# EAGLE design simpleCH552 (EAGLE 9.5.0)
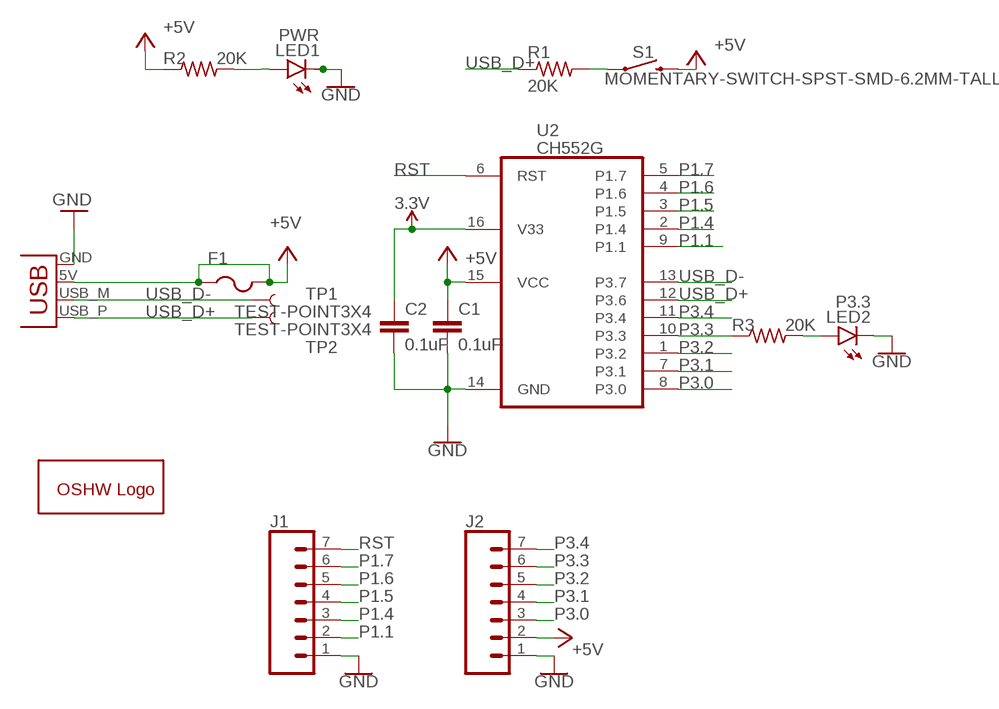
[diagram p0: schematic, sheet 1]

## Parts
C1  0.1uF  C-EUC0805K  [C0805K]
C2  0.1uF  C-EUC0805K  [C0805K]
F1  PTCFUSE-1206  [R1206]
GOLD_ORB_SM1  OSHWLOGOLOGO8MM  [OSHW_8MM]
J1  CONN_07NO_SILK  [1X07_NO_SILK]
J2  CONN_07NO_SILK  [1X07_NO_SILK]
LED1  PWR  GHI-BASICCOMPONENTS_LED-(INCH)-0805  [GHI-BASICCOMPONENTS_0805-LED]
LED2  P3.3  GHI-BASICCOMPONENTS_LED-(INCH)-0805  [GHI-BASICCOMPONENTS_0805-LED]
R1  20K  R-US_R0805  [R0805]
R2  20K  R-US_R0805  [R0805]
R3  20K  R-US_R0805  [R0805]
S1  MOMENTARY-SWITCH-SPST-SMD-6.2MM-TALL  [TACTILE_SWITCH_SMD_6.2MM_TALL]
TP1  TEST-POINT3X4  [PAD.03X.04]
TP2  TEST-POINT3X4  [PAD.03X.04]
U2  CH552G  MY_IC_CH551G_CH552GSOP-16  [MY_IC_SO16]
X1  USBPCB  [USB-A-PCB]

## Nets
3.3V: C2.1 U2.16(V33)
+5V: C1.1 F1.1 F1.2 J2.2 R2.1 S1.B2 U2.15(VCC) X1.5V(VBUS)
GND: C1.2 C2.2 J1.1 J2.1 LED1.K LED2.K U2.14(GND) X1.GND
N$1: R1.2 S1.A2
N$2: LED2.A R3.2
N$3: LED1.A R2.2
P1.1: J1.2 U2.9(P1.1)
P1.4: J1.3 U2.2(P1.4)
P1.5: J1.4 U2.3(P1.5)
P1.6: J1.5 U2.4(P1.6)
P1.7: J1.6 U2.5(P1.7)
P3.0: J2.3 U2.8(P3.0)
P3.1: J2.4 U2.7(P3.1)
P3.2: J2.5 U2.1(P3.2)
P3.3: J2.6 R3.1 U2.10(P3.3)
P3.4: J2.7 U2.11(P3.4)
RST: J1.7 U2.6(RST)
USB_D+: R1.1 TP2.P$1 U2.12(P3.6) X1.USB_P(D+)
USB_D-: TP1.P$1 U2.13(P3.7) X1.USB_M(D-)

## Library data of the parts
C1 C2 = rcl:C-EU: CAPACITOR, European symbol; LCSC: C16834; SPICEPREFIX: C
F1 = adafruit:PTCFUSE: PTC fuses, resettable thermistors; LCSC: C151162
GOLD_ORB_SM1 = oshw:OSHWLOGO: The OSHW logo for PCB layout
J1 J2 = SparkFun-Connectors:CONN_07: Multi connection point. Often used as Generic Header-pin footprint for 0.1 inch spaced/style header connections On any of the 0.1 inch spaced packages, you can populate with these: Break Away Headers - Straight <https://www.sparkfun.com/products/116> (PRT-00116) Break Away Male Headers - Right Angle <https://www.sparkfun.com/products/553> (PRT-00553) Female Headers <https://www.sparkfun.com/products/115> (PRT-00115) Break Away Headers - Machine Pin <https://www.sparkfun.com/products/117> (PRT-00117) Break Away Female Headers - Swiss Machine Pin <https://www.sparkfun.com/products/743> (PRT-00743) For SCREWTERMINALS and SPRING TERMINALS visit here: Screw Terimnals on SparkFun.com <https://www.sparkfun.com/search/results?term=Screw+Terminals> (5mm/3.5mm/2.54mm spacing) This device is also useful as a general connection point to wire up your design to another part of your project. Our various solder wires solder well into these plated through hole pads. Hook-Up Wire - Assortment (Stranded, 22 AWG) <https://www.sparkfun.com/products/11375> (PRT-11375) Hook-Up Wire - Assortment (Solid Core, 22 AWG) <https://www.sparkfun.com/products/11367> (PRT-11367) View the entire wire category on our website here <https://www.sparkfun.com/categories/141> Special notes: Molex polarized connector foot print use with SKU : PRT-08231 with associated crimp pins and housings. 1MM SMD Version SKU: PRT-10208 NOTES ON THE VARIANTS LOCK and LOCK_LONGPADS... This footprint was designed to help hold the alignment of a through-hole component (i.e. 6-pin header) while soldering it into place. You may notice that each hole has been shifted either up or down by 0.005 of an inch from it's more standard position (which is a perfectly straight line). This slight alteration caused the pins (the squares in the middle) to touch the edges of the holes. Because they are alternating, it causes a "brace" to hold the component in place. 0.005 has proven to be the perfect amount of "off-center" position when using our standard breakaway headers. Although looks a little odd when you look at the bare footprint, once you have a header in there, the alteration is very hard to notice. Also,if you push a header all the way into place, it is covered up entirely on the bottom side.
LED1 LED2 = BeagleBone_Black_Wireless:GHI-BASICCOMPONENTS_LED-(INCH)-
R1-R3 = rcl:R-US_: RESISTOR, American symbol; SPICEPREFIX: R
S1 = SparkFun-Switches:MOMENTARY-SWITCH-SPST: Momentary Switch (Pushbutton) - SPST Normally-open (NO) SPST momentary switches (buttons, pushbuttons). Variants PTH-12MM - 12mm square, through-hole Momentary Pushbutton Switch - 12mm Square <https://www.sparkfun.com/products/9190> (COM-09190) PTH-6.0MM, PTH-6.0MM-KIT - 6.0mm square, through-hole Mini Pushbutton Switch <https://www.sparkfun.com/products/97> (COM-00097) KIT package intended for soldering kit's - only one side of pads' copper is exposed. PTH-RIGHT-ANGLE-KIT - Right-angle, through-hole Right Angle Tactile Button <https://www.sparkfun.com/products/10791> - Used on SparkFun BigTime Watch Kit <https://www.sparkfun.com/products/11734> SMD-12MM - 12mm square, surface-mount Tactile Button - SMD (12mm) <https://www.sparkfun.com/products/12993> (COM-12993) Used on SparkFun PicoBoard <https://www.sparkfun.com/products/11888> SMD-4.5MM - 4.5mm Square Trackball Switch Used on SparkFun Blackberry Trackballer Breakout <https://www.sparkfun.com/products/13169> SMD-4.6MMX2.8MM - 4.60mm x 2.80mm, surface mount Used on SparkFun SAMD21 Mini Breakout <https://www.sparkfun.com/products/13664> SMD-5.2MM, SMD-5.2-REDUNDANT - 5.2mm square, surface-mount Mini Pushbutton Switch - SMD <https://www.sparkfun.com/products/8720> (COM-08720) Used on Arduino Pro Mini <https://www.sparkfun.com/products/11114> REDUNDANT package connects both switch circuits together SMD-6.0X3.5MM - 6.0 x 3.5mm, surface mount Momentary Reset Switch SMD <https://www.sparkfun.com/products/8229> (COM-08229) SMD-6.2MM-TALL - 6.2mm square, surface mount Tactile Button - SMD (6mm) <https://www.sparkfun.com/products/12992> Used on SparkFun Digital Sandbox <https://www.sparkfun.com/products/12651> SMD-RIGHT-ANGLE - Right-angle, surface mount Used on SparkFun Block for Intel® Edison - Arduino <https://www.sparkfun.com/products/13036>; PROD_ID: SWCH-11966; SF_SKU: COM-12992
TP1 TP2 = SparkFun-Connectors:TEST-POINT: SparkFun Test Points Bare copper test points for troubleshooting or In-Circuit-Testing. These are used by our Production team for verifying production board runs using pogo-pins on test beds. SparkFun Products: SparkFun LSM9DS1 Breakout <https://www.sparkfun.com/products/13284> SparkFun PSOC <https://www.sparkfun.com/products/13714> SparkFun Load Cell Amplifier <https://www.sparkfun.com/products/13879>
U2 = myOwnLib:MY_IC_CH551G_CH552G; LCSC: C111292
X1 = SparkFun:USB: USB Connectors USB-B-PTH is fully proven SKU : PRT-00139 USB-miniB is fully proven SKU : PRT-00587 USB-A-PCB is untested. USB-A-H is throughly reviewed, but untested. Spark Fun Electronics SKU : PRT-00437 USB-B-SMT is throughly reviewed, but untested. Needs silkscreen touching up. USB-A-S has not been used/tested USB-MB-H has not been used/tested

## Board
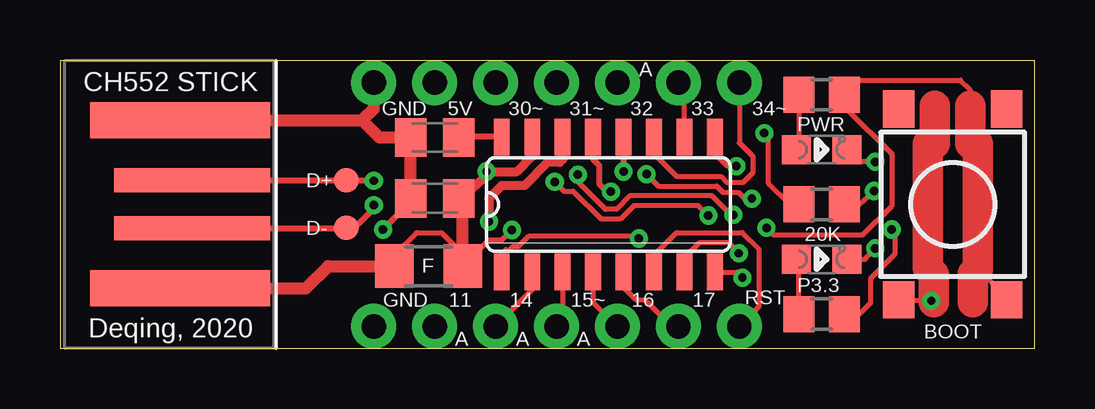
[diagram p1: board, top side]
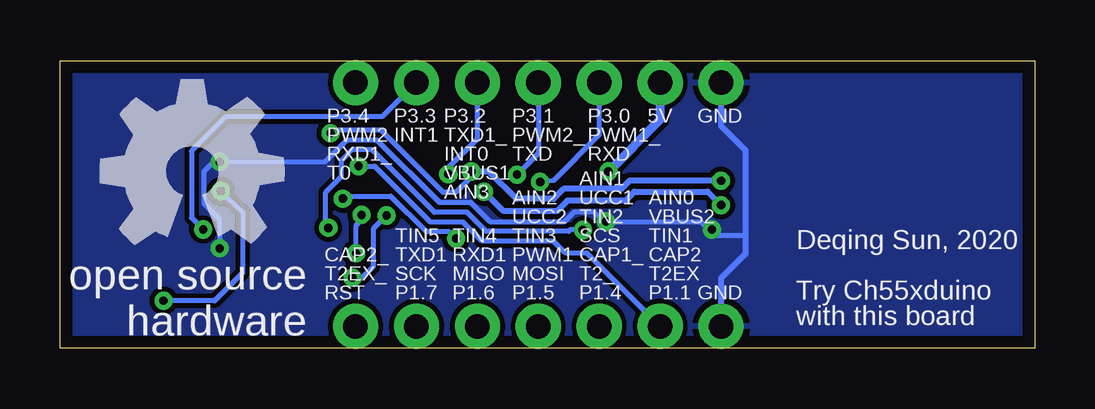
[diagram p2: board, bottom side, seen from below]

Size 40.64 x 11.99 mm. Coordinates in mm from the lower left corner, seen from the top.
Outline: 0,0 40.64,0 40.64,11.99 0,11.99 0,0
Copper layers (1*16): Top 0.035mm / dielectric 1.5mm / Bottom 0.035mm
Design rules "eagleRules10Mil *": minimum track width 8mil, minimum drill 0.3mm, track to track 8mil, track to pad 8mil, pad to pad 8mil, via to via 8mil, smd to smd 8mil, copper to edge 20mil, drill to drill 20mil, minimum pad ring 10mil, minimum via ring 8mil, stop-mask expansion 4mil, vias tented up to drill 14mil, thermal gap 10mil

### Footprints (pad centres in the part's own frame; a part is rotated, then mirrored left to right if it is on the bottom)
C0805K = smd 1.3 x 1.6: 1 -1,0; 2 1,0
R1206 = smd 1.6 x 1.803: 1 -1.422,0; 2 1.422,0
1X07_NO_SILK = drill 1.016 pad 1.88: 1 0,0; 2 2.54,0; 3 5.08,0; 4 7.62,0; 5 10.16,0; 6 12.7,0; 7 15.24,0
GHI-BASICCOMPONENTS_0805-LED = smd 1.2 x 1.2: A 0,1.05; K 0,-1.05
R0805 = smd 1.3 x 1.5: 1 -0.95,0; 2 0.95,0
TACTILE_SWITCH_SMD_6.2MM_TALL = smd 1.55 x 1.3: A1 -3.975,-2.25; A2 3.975,-2.25; B1 -3.975,2.25; B2 3.975,2.25
PAD.03X.04 = smd 1.016 x 1.016: P$1 0,0
MY_IC_SO16 = smd 0.66 x 1.524: 1 -4.445,-2.819; 2 -3.175,-2.819; 3 -1.905,-2.819; 4 -0.635,-2.819; 5 0.635,-2.819; 6 1.905,-2.819; 7 3.175,-2.819; 8 4.445,-2.819; 9 4.445,2.819; 10 3.175,2.819; 11 1.905,2.819; 12 0.635,2.819; 13 -0.635,2.819; 14 -1.905,2.819; 15 -3.175,2.819; 16 -4.445,2.819
USB-A-PCB = smd 7.5 x 1.5: 5V -0.2,-3.5; GND -0.2,3.5 | smd 6.5 x 1: USB_M 0.3,-1; USB_P 0.3,1

### Placement (x,y rotation side)
C1  15.62,6.25 180 top
C2  15.62,8.79 180 top
F1  15.37,3.43 0 top
GOLD_ORB_SM1  35.15,7.37 0 bottom
J1  13.08,0.91 0 top
J2  13.08,11.07 0 top
LED1  31.75,8.28 90 top
LED2  31.75,3.71 90 top
R1  31.75,5.99 0 top
R2  31.75,10.57 180 top
R3  31.75,1.42 180 top
S1  37.21,5.99 270 top
TP1  11.94,5.03 0 top
TP2  11.94,7.01 0 top
U2  22.86,5.99 0 top
X1  5.21,5.99 0 top

### Tracks (layer width: path | path; a pad name or v marks a point on that pad's centre or on a via)
3.3V
  Top 0.254: U2.16 16.65,8.81 C2.1
+5V  (via drill 0.35)
  Top 0.203: F1.1 13.95,3.91 14.86,4.83 15.9,4.83 16.79,3.94 | F1.2 17.88,4.52 18.43,4.52 v18.84,4.93 | 32.7,10.07 32.79,9.98 | 32.79,9.98 34.7,8.08 34.7,5.94 33.48,4.72 29.75,4.72 v29.45,5.02 | S1.B2 39.46,2.14 38.25,3.3 38.2,3.35 38.2,3.25 38.05,3.1 | 38.25,8.53 37.95,8.53 | 37.95,10.11 37.95,10.77 37.54,11.18 33.31,11.18 R2.1 32.79,10.47 32.79,9.98
  Top 0.254: C1.1 16.79,6.25 | 17.78,7.24 v17.78,7.37
  Top 0.305: 16.79,6.25 16.64,6.25 C1.1
  Top 0.381: v17.78,7.37 19.05,7.37 19.68,8 U2.15 | 16.79,6.25 17.78,7.24
  Top 0.508: X1.5V 10.24,2.49 11.18,3.43 F1.1 | F1.2 16.79,3.94 16.79,6.1 16.64,6.25
  Top 1.27: 38.25,8.53 38.25,3.3 | 37.95,10.11 37.95,8.53 | 38.05,3.1 38.05,1.93
  Bottom 0.203: v18.84,4.93 19.39,4.93 19.44,4.88 22.88,4.88 23.66,5.66 25.02,5.66 27.63,8.27 28.48,8.27 28.91,7.84 28.91,7.16 29.57,6.5 29.57,5.33 29.45,5.22 v29.45,5.02
  Bottom 0.381: J2.2 15.62,9.53 v17.78,7.37
GND  (via drill 0.35)
  Top 0.203: v33.98,7.77 33.31,7.77 LED1.K | LED2.K 33.56,3.71 33.98,4.13 v33.98,4.17
  Top 0.254: C1.2 14.62,6.11 v13.46,4.95
  Top 0.381: v17.88,5.28 17.88,6.25 18.41,6.78 19.36,6.78 20.32,7.75 20.83,7.75 20.95,7.87 U2.14
  Top 0.508: X1.GND 12.6,9.49 | 12.6,9.49 13.31,8.79 C2.2 C1.2 | J2.1 13.08,9.97 12.6,9.49
  Bottom 0.203: 12.06,4.7 13.34,4.7 13.92,5.28 v17.88,5.28 17.98,5.28 18.39,5.69 19.2,5.69 19.61,5.28 22.71,5.28 23.5,6.07 24.81,6.07 27.41,8.68 28.68,8.68 29.59,7.77 v33.98,7.77 34.24,7.77 34.65,7.37 34.65,6.04 33.98,5.38 v33.98,4.17
  Bottom 0.254: J2.1 13.08,9.27 12.06,8.26 12.06,4.7 12.06,3.94 13.08,2.92 J1.1
  pour Bottom: 0,0 40.64,0 40.64,11.99 0,11.99
N$1  (via drill 0.35)
  Top 0.203: R1.2 33.33,5.99 v33.93,6.55 | S1.A2 35,1.98 v36.32,1.98 36.37,1.98 36.42,1.93 | 36.17,8.53 36.47,8.53 | 36.17,3.34 36.42,3.08
  Top 1.27: 36.17,8.53 36.17,3.34 | 36.47,8.53 36.47,10.11 | 36.42,1.93 36.42,3.08
  Bottom 0.203: v33.93,6.55 33.02,5.69 33.02,3.15 34.19,1.98 v36.32,1.98
N$2
  Top 0.203: R3.2 30.8,3.61 LED2.A
N$3
  Top 0.203: R2.2 30.8,8.38 LED1.A
P1.1  (via drill 0.35)
  Top 0.203: v28.19,7.59 27.82,7.59 27.28,8.13 27.28,8.79 U2.9
  Bottom 0.203: J1.2 18.67,3.96 19.56,3.96 20.07,4.47 23.04,4.47 23.83,5.26 25.19,5.26 27.52,7.59 v28.19,7.59
P1.4
  Top 0.203: U2.2 19.68,2.44 J1.3
P1.5
  Top 0.203: U2.3 20.95,1.17 J1.4
P1.6
  Top 0.203: U2.4 22.23,1.93 J1.5
P1.7
  Top 0.203: U2.5 23.5,2.54 24,2.03 24.38,2.03 25.32,1.09 25.6,1.09 J1.6
P3.0  (via drill 0.35)
  Top 0.203: v20.62,6.93 21.01,6.55 21.4,6.55 22.56,5.38 23.36,5.38 23.92,5.94 26.62,5.94 v27.03,5.54 | U2.8 28.22,3.17 v28.45,2.95
  Bottom 0.203: J2.3 18.16,8.89 20.07,6.99 v20.62,6.93 | v28.45,2.95 28.04,2.95 27.58,3.4 27.58,4.98 v27.03,5.54
P3.1  (via drill 0.35)
  Top 0.203: v21.59,7.24 21.59,6.93 22.73,5.79 23.19,5.79 23.75,6.35 27.18,6.35 27.97,5.56 v28.07,5.56 | U2.7 26.04,3.79 26.67,4.42 27.84,4.42 v28.3,3.96
  Bottom 0.203: J2.4 20.7,8.13 v21.59,7.24 | v28.3,3.96 28.3,5.13 28.07,5.36 v28.07,5.56
P3.2  (via drill 0.35)
  Top 0.203: U2.1 18.41,3.94 18.59,4.12 18.75,4.12 18.89,4.25 19.12,4.25 19.56,4.68 24.02,4.68 v24.13,4.58 | v24.45,7.26 24.96,6.76 27.38,6.76 27.64,6.5 28.29,6.5 28.55,6.24 v28.85,6.24
  Bottom 0.203: J2.5 23.24,8.74 24.45,7.52 v24.45,7.26 | v24.13,4.58 24.41,4.85 25.36,4.85 26.85,6.34 28.74,6.34 v28.85,6.24
P3.3  (via drill 0.35)
  Top 0.203: U2.10 26.04,10.82 J2.6 | v34.67,4.95 34.8,4.83 34.8,3.91 33.78,2.9 33.78,1.88 33.33,1.42 R3.1
  Bottom 0.203: J2.6 27.2,9.65 33.73,9.65 35.15,8.23 35.15,5.43 v34.67,4.95
P3.4
  Top 0.203: U2.11 24.77,8.1 25.7,7.16 27.55,7.16 27.8,6.91 27.91,6.91 28.48,6.91 28.87,7.3 28.88,7.31 28.88,7.52 28.88,8 28.32,8.56 J2.7
RST
  Top 0.203: U2.6 24.77,3.89 25.7,4.83 28.45,4.83 29.13,4.14 29.13,1.72 J1.7
USB_D+  (via drill 0.35)
  Top 0.203: TP2.P$1 11.96,6.99 v13.08,6.99 | v29.36,8.97 29.52,8.81 29.52,6.91 30.43,5.99 R1.1
  Top 0.254: U2.12 v23.5,7.37 | v13.08,6.99 X1.USB_P
  Bottom 0.203: v23.5,7.37 23.5,7.14 24.13,6.5 24.66,6.5 27.25,9.09 29.01,9.09 29.11,9.09 29.24,9.09 v29.36,8.97
  Bottom 0.254: v23.5,7.37 22.75,7.37 21.6,6.22 20.07,6.22 19.65,6.64 17.23,6.64 16.89,6.99 v13.08,6.99
USB_D-  (via drill 0.35)
  Top 0.203: TP1.P$1 12.22,5.03 12.26,4.99
  Top 0.254: X1.USB_M 12.26,4.99 13.08,5.82 v13.08,5.97 | U2.13 22.23,7.87 22.48,7.62 22.48,6.86 22.81,6.53 v22.96,6.53
  Bottom 0.254: v13.08,5.97 13.64,6.53 16.7,6.53 17.08,6.15 19.49,6.15 19.93,5.71 22.15,5.71 v22.96,6.53

### Text on the board
tNames: CH552 STICK | A | GND | 5V | 30~ | 31~ | 32 | 33 | 34~ | PWR | D+ | D- | 20K | F | GND | 11 | 14 | 15~ | 16 | 17 | RST | P3.3 | Deqing, 2020 | A | A | A | BOOT
bNames: GND | 5V | P3.0 / PWM1_ / RXD | P3.1 / PWM2_ / TXD | P3.2 / TXD1_ / INT0 / VBUS1 / AIN3 | P3.3 / INT1 | P3.4 / PWM2 / RXD1_ / T0 | GND | AIN0 / VBUS2 / TIN1 / CAP2 / T2EX / P1.1 | AIN1 / UCC1 / TIN2 / SCS / CAP1_ / T2_ / P1.4 | AIN2 / UCC2 / TIN3 / PWM1 / MOSI / P1.5 | TIN4 / RXD1 / MISO / P1.6 | TIN5 / TXD1 / SCK / P1.7 | CAP2_ / T2EX_ / RST | Deqing Sun, 2020 / / Try Ch55xduino / with this board